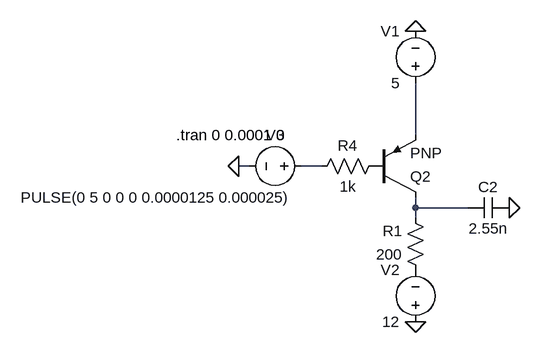
[diagram p0: schematic sender.asc]
sender.asc, the LTspice schematic file:
Version 4
SHEET 1 980 680
WIRE 320 288 320 208
WIRE 64 336 48 336
WIRE 176 336 144 336
WIRE 320 400 320 384
WIRE 400 400 320 400
WIRE 320 416 320 400
FLAG 48 336 0
FLAG 320 576 0
FLAG 464 400 0
FLAG 320 128 0
SYMBOL cap 464 384 R90
WINDOW 0 0 32 VBottom 2
WINDOW 3 32 32 VTop 2
SYMATTR InstName C2
SYMATTR Value 2.55n
SYMBOL voltage 160 336 R90
WINDOW 0 -32 56 VBottom 2
WINDOW 3 33 238 VTop 2
WINDOW 123 0 0 Left 2
WINDOW 39 0 0 Left 2
SYMATTR InstName V3
SYMATTR Value PULSE(0 5 0 0 0 0.0000125 0.000025)
SYMBOL pnp 256 384 M180
SYMATTR InstName Q2
SYMBOL res 272 320 R90
WINDOW 0 0 56 VBottom 2
WINDOW 3 32 56 VTop 2
SYMATTR InstName R4
SYMATTR Value 1k
SYMBOL voltage 320 592 R180
WINDOW 0 24 96 Left 2
WINDOW 3 24 16 Left 2
WINDOW 123 0 0 Left 2
WINDOW 39 0 0 Left 2
SYMATTR InstName V2
SYMATTR Value 12
SYMBOL res 336 512 R180
WINDOW 0 36 76 Left 2
WINDOW 3 36 40 Left 2
SYMATTR InstName R1
SYMATTR Value 200
SYMBOL voltage 320 224 R180
WINDOW 0 24 96 Left 2
WINDOW 3 24 16 Left 2
WINDOW 123 0 0 Left 2
WINDOW 39 0 0 Left 2
SYMATTR InstName V1
SYMATTR Value 5
TEXT -48 288 Left 2 !.tran 0 0.0001 0

The netlist it stands for:
* sender.asc
C2 0 N003 2.55n
V3 N002 0 PULSE(0 5 0 0 0 0.0000125 0.000025)
Q2 N003 P001 N001 0 PNP
R4 P001 N002 1k
V2 0 P002 12
R1 P002 N003 200
V1 N001 0 5
.model NPN NPN
.model PNP PNP
.lib standard.bjt
.tran 0 0.0001 0
.backanno
.end